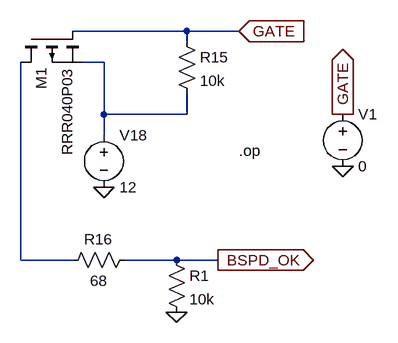
[diagram p0: schematic mosfet.asc]
mosfet.asc, the LTspice schematic file:
Version 4
SHEET 1 3164 1616
WIRE 2800 528 2624 528
WIRE 2880 528 2800 528
WIRE 2800 544 2800 528
WIRE 2672 576 2640 576
WIRE 2672 656 2672 576
WIRE 2800 656 2800 624
WIRE 2800 656 2672 656
WIRE 2672 688 2672 656
WIRE 2544 880 2544 576
WIRE 2624 880 2544 880
WIRE 2784 880 2704 880
WIRE 2848 880 2784 880
FLAG 2672 768 0
FLAG 2848 880 BSPD_OK
IOPIN 2848 880 Out
FLAG 2880 528 GATE
IOPIN 2880 528 In
FLAG 3040 736 0
FLAG 3040 656 GATE
IOPIN 3040 656 Out
FLAG 2784 960 0
SYMBOL voltage 2672 672 R0
SYMATTR InstName V18
SYMATTR Value 12
SYMBOL res 2784 528 R0
SYMATTR InstName R15
SYMATTR Value 10k
SYMBOL res 2720 864 R90
WINDOW 0 0 56 VBottom 2
WINDOW 3 32 56 VTop 2
SYMATTR InstName R16
SYMATTR Value 68
SYMBOL voltage 3040 640 R0
WINDOW 123 0 0 Left 0
WINDOW 39 0 0 Left 0
SYMATTR InstName V1
SYMATTR Value 0
SYMBOL pmos 2544 528 M90
SYMATTR InstName M1
SYMATTR Value RRR040P03
SYMBOL res 2768 864 R0
SYMATTR InstName R1
SYMATTR Value 10k
TEXT 2880 712 Left 2 !.op

The netlist it stands for:
* mosfet.asc
V18 N001 0 12
R15 GATE N001 10k
R16 BSPD_OK N002 68
V1 GATE 0 0
M1 N002 GATE N001 N001 RRR040P03
R1 BSPD_OK 0 10k
.model NMOS NMOS
.model PMOS PMOS
.lib standard.mos
.op
.backanno
.end